# Altium schematic sheet External ADC and Reference.SchDoc: Yonder Parent TS-4900 Version
size Letter; DrawnBy: MTAN; Organization: Altium Limited; DocumentNumber: 5; Revision: D; SheetNumber: 5; SheetTotal: 5
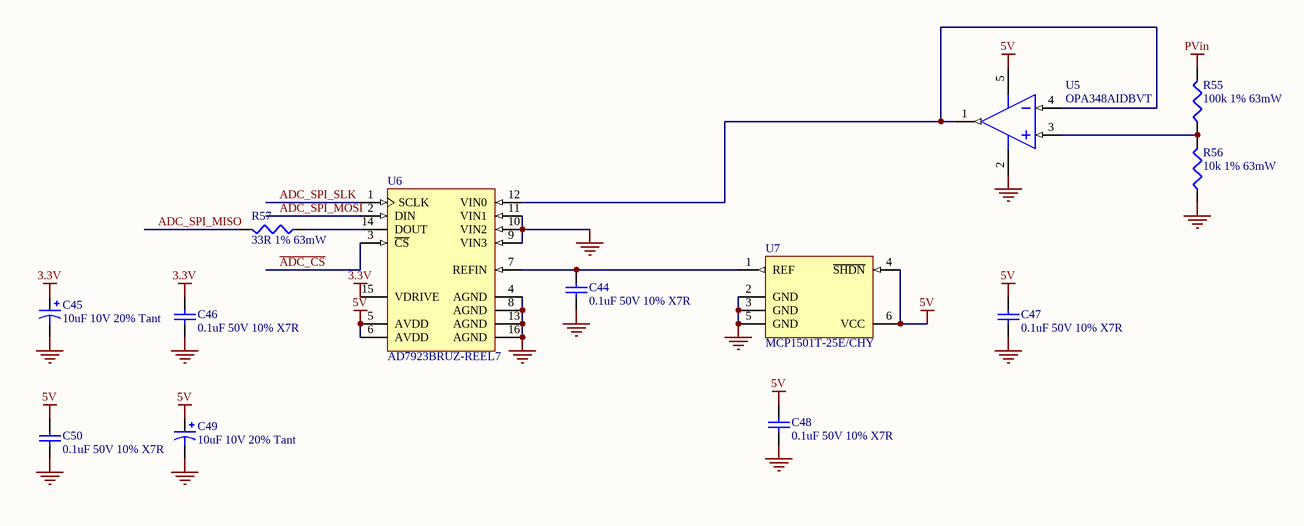
[diagram p0: External ADC and Reference.SchDoc]

## Parts
C44  0.1uF 50V 10% X7R  [CAPC1005L]
C45  10uF 10V 20% Tant  [C0805]
C46  0.1uF 50V 10% X7R  [CAPC1005L]
C47  0.1uF 50V 10% X7R  [CAPC1005L]
C48  0.1uF 50V 10% X7R  [CAPC1005L]
C49  10uF 10V 20% Tant  [C0805]
C50  0.1uF 50V 10% X7R  [CAPC1005L]
R55  100k 1% 63mW  [RESC1005L]
R56  10k 1% 63mW  [RESC1005L]
R57  33R 1% 63mW  [RESC1005L]
U5  OPA348AIDBVT  [TI-DBV5_L]
U6  AD7923BRUZ-REEL7  [RU-16_L]
U7  MCP1501T-25E/CHY  [SOT23-6_L]

## Nets
3.3V: C45.1 C46.1 U6.15(VDRIVE)
5V: C47.1 C48.1 C49.1 C50.1 U5.5(V+) U6.5(AVDD) U6.6(AVDD) U7.4(~{SHDN}) U7.6(VCC)
GND: C44.2 C45.2 C46.2 C47.2 C48.2 C49.2 C50.2 R56.1 U5.2(V-) U6.4(AGND) U6.8(AGND) U6.9(VIN3) U6.10(VIN2) U6.11(VIN1) U6.13(AGND) U6.16(AGND) U7.2(GND) U7.3(GND) U7.5(GND)
PVin: R55.2
~{ADC_CS}: U6.3(~{CS})
ADC_SPI_MISO: R57.2
ADC_SPI_MOSI: U6.2(DIN)
ADC_SPI_SLK: U6.1(SCLK)
NetC44_1: C44.1 U6.7(REFIN) U7.1(REF)
NetR55_1: R55.1 R56.2 U5.3(IN+)
NetR57_1: R57.1 U6.14(DOUT)
NetU5_1: U5.1(OUT) U5.4(IN-) U6.12(VIN0)

## Notes on the sheet
- Title
- Drawn By:
- Date:
- Time:
- Revision:
- Sheet
- of
- The Latium Group of Companies
- 1312 10 Street
- Nisku, Alberta
- T9E 8K2
- Canada
- File:

## Library data of the parts
C44 C46-C48 C50 = Cap: Capacitor; Value: 0.1uF 50V 10% X7R
C45 C49 = Cap Pol3: CAP TANT 10UF 20% 10V 0805; Manufacturer: AVX Corporation; Manufacturer Part Number: TLJR106M010R3000; Value: 10uF 10V 20% Tant; Supplier 1: Digi-Key; Supplier 1 Part Number: 478-3346-1-ND
R55-R57 = Res3: Resistor
  R55: Value: 100k 1% 63mW
  R56: Value: 10k 1% 63mW
  R57: Value: 33R 1% 63mW
U5 = OPA348AIDBVT: IC OPAMP GP 1 CIRCUIT SOT23-5; Manufacturer: Texas Instruments; ComponentLink1Description: Data Sheet; ComponentLink1URL: S:\Hardware\Data Sheets\Active\Amps\opa2348.pdf; Value: OPA348AIDBVT; Manufacturer Part Number: OPA348AIDBVT; Supplier 1: Digi-Key; Supplier 1 Part Number: 296-12276-1-ND
U6 = AD7923BRUZ-REEL7: IC ADC 12BIT SAR 16TSSOP; Manufacturer: Analog Devices Inc; ComponentLink1Description: Data Sheet; ComponentLink1URL: S:\Hardware\Data Sheets\Active\ADCs\AD7923-1.pdf; Value: AD7923BRUZ-REEL7; Manufacturer Part Number: AD7923BRUZ-REEL7; Supplier 1: Digi-Key; Supplier 1 Part Number: AD7923BRUZ-REEL7CT-ND
U7 = MAX6610AUT+: IC VREF SERIES 0.1% SOT23-6; Manufacturer: Microchip Technology; ComponentLink1Description: Data Sheet; ComponentLink1URL: S:\Hardware\Data Sheets\Active\References\MCP1501.pdf; Value: MCP1501T-25E/CHY; Manufacturer Part Number: MCP1501T-25E/CHY; Supplier 1: Digi-Key; Supplier 1 Part Number: MCP1501T-25E/CHYCT-ND